# EAGLE design Project_Amp_RevA (EAGLE 7.5.0)
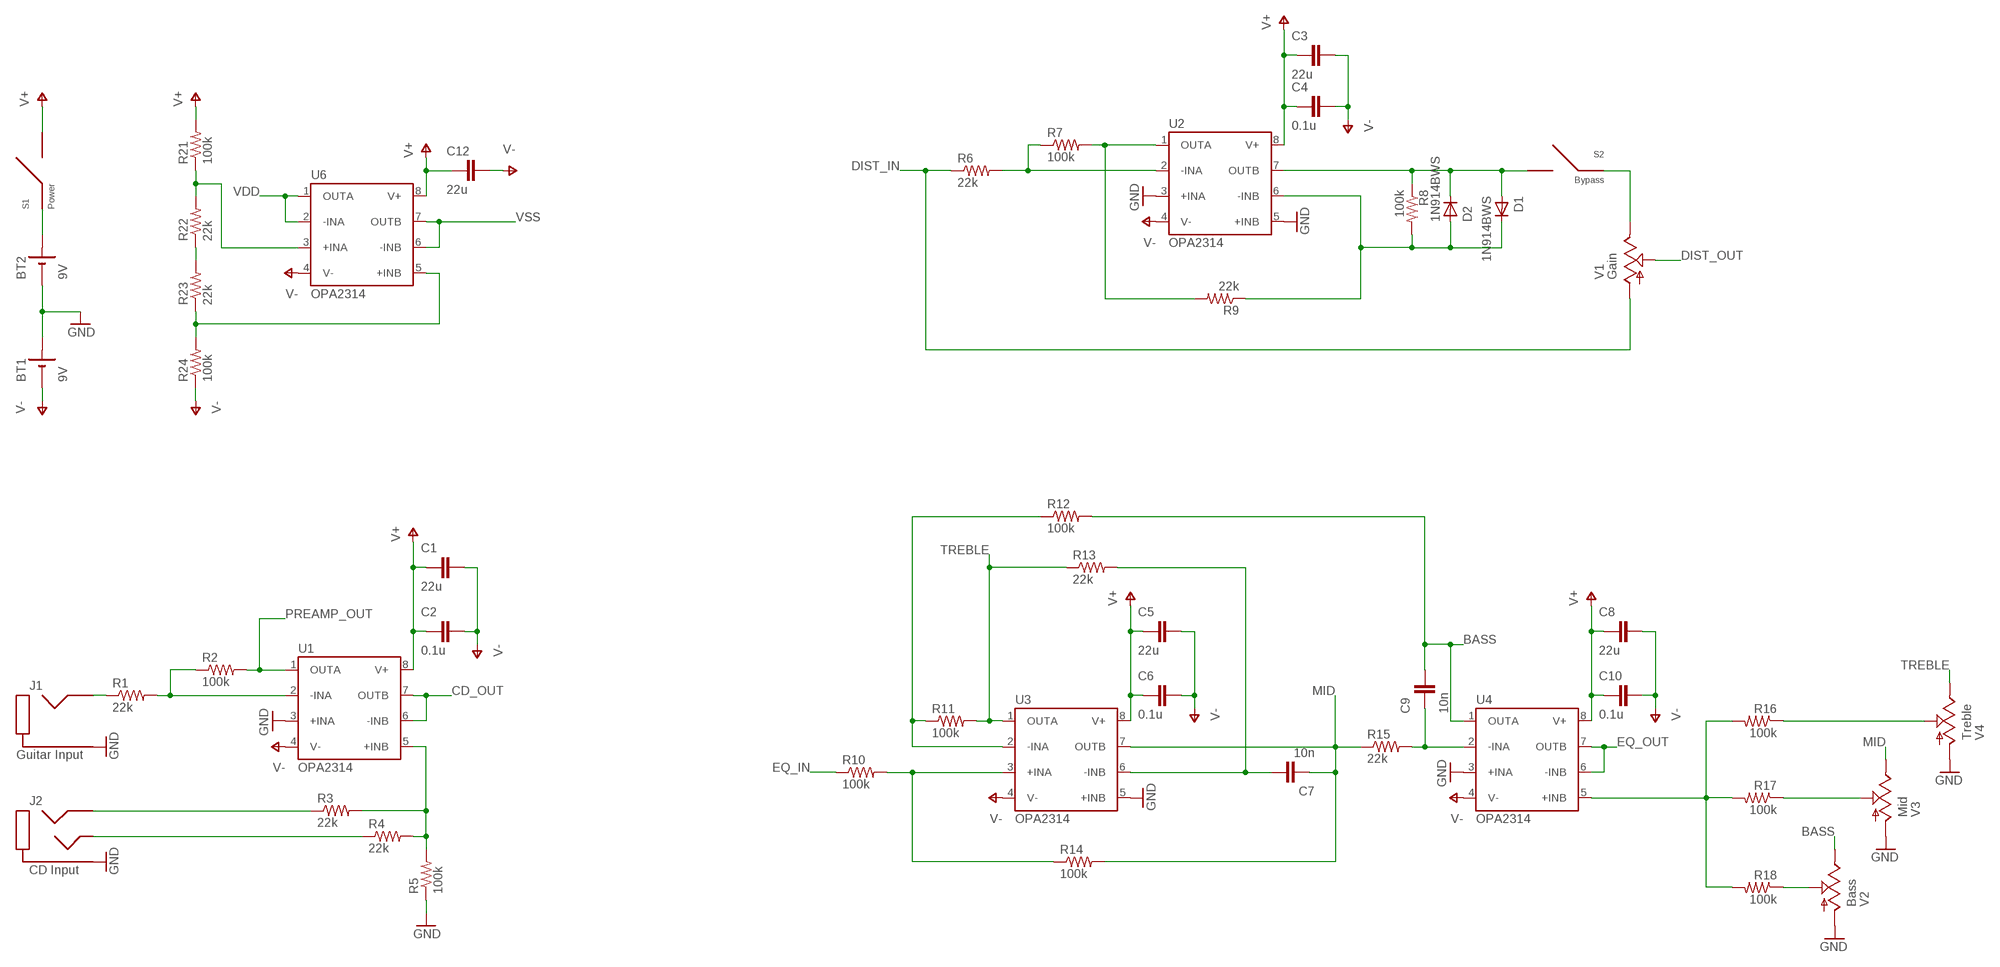
[diagram p0: schematic, sheet 1, part 1 of 2]
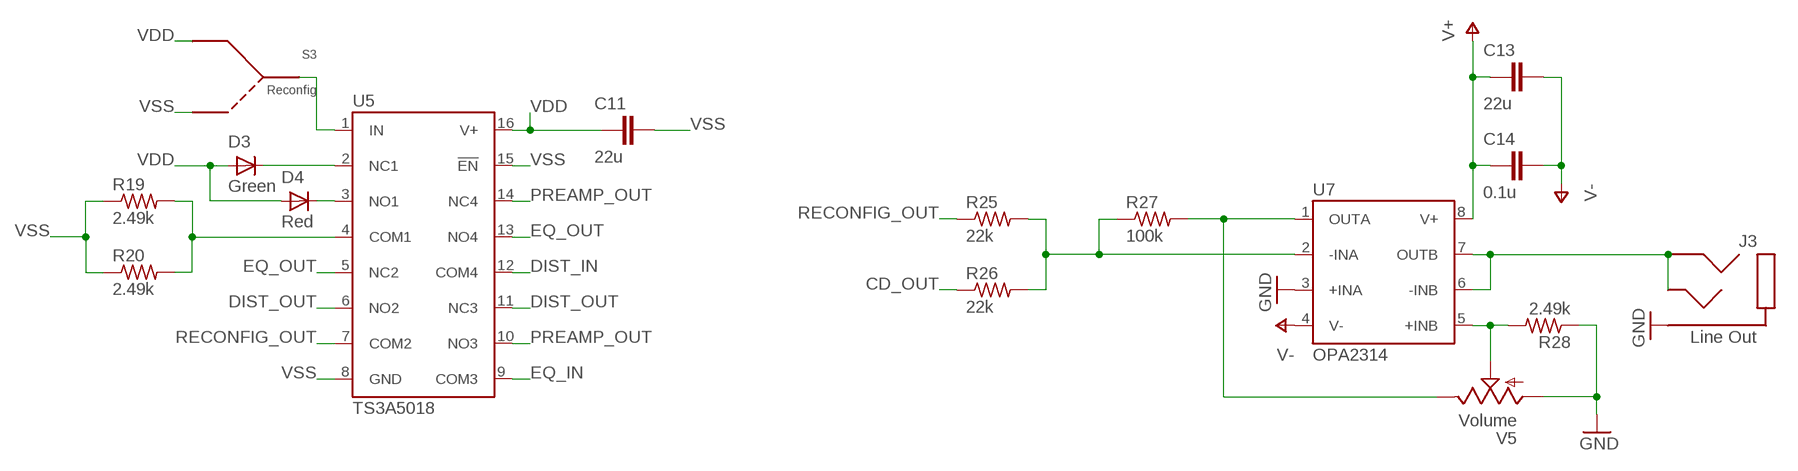
[diagram p1: schematic, sheet 1, part 2 of 2]

## Parts
BT1  9V  9V59X"  [9V59X]
BT2  9V  9V59X"  [9V59X]
C1  22u  C1206  [C1206]
C2  0.1u  C0402  [C0402]
C3  22u  C1206  [C1206]
C4  0.1u  C0402  [C0402]
C5  22u  C1206  [C1206]
C6  0.1u  C0402  [C0402]
C7  10n  CTHRU  [ECW-F6103HL]
C8  22u  C1206  [C1206]
C9  10n  CTHRU  [ECW-F6103HL]
C10  0.1u  C0402  [C0402]
C11  22u  C1206  [C1206]
C12  22u  C1206  [C1206]
C13  22u  C1206  [C1206]
C14  0.1u  C0402  [C0402]
D1  1N914BWS  DSOD-323F  [SOD-323F]
D2  1N914BWS  DSOD-323F  [SOD-323F]
D3  Green  D  [R0402]
D4  Red  D  [R0402]
J1  Guitar Input  RA49C12B  [RA49C12B]
J2  CD Input  SJ1-3513-SMT-TR  [SJ1-3513-SMT-TR]
J3  Line Out  SJ1-3513-SMT-TR  [SJ1-3513-SMT-TR]
R1  22k  R0402  [R0402]
R2  100k  R0402  [R0402]
R3  22k  R0402  [R0402]
R4  22k  R0402  [R0402]
R5  100k  R0402  [R0402]
R6  22k  R0402  [R0402]
R7  100k  R0402  [R0402]
R8  100k  R0402  [R0402]
R9  22k  R0402  [R0402]
R10  100k  R0402  [R0402]
R11  100k  R0402  [R0402]
R12  100k  R0402  [R0402]
R13  22k  R0402  [R0402]
R14  100k  R0402  [R0402]
R15  22k  R0402  [R0402]
R16  100k  R0402  [R0402]
R17  100k  R0402  [R0402]
R18  100k  R0402  [R0402]
R19  2.49k  R0402  [R0402]
R20  2.49k  R0402  [R0402]
R21  100k  R0402  [R0402]
R22  22k  R0402  [R0402]
R23  22k  R0402  [R0402]
R24  100k  R0402  [R0402]
R25  22k  R0402  [R0402]
R26  22k  R0402  [R0402]
R27  100k  R0402  [R0402]
R28  2.49k  R0402  [R0402]
S1  Power  TMS6T5B2M2RE  [TMS6T5B2M2RE]
S2  Bypass  TMS6T5B2M2RE  [TMS6T5B2M2RE]
S3  Reconfig  TMS1T5B2M2RE  [TMS1T5B2M2R]
U1  OPA2314  OPA2314SOIC  [8-SOIC]
U2  OPA2314  OPA2314SOIC  [8-SOIC]
U3  OPA2314  OPA2314SOIC  [8-SOIC]
U4  OPA2314  OPA2314SOIC  [8-SOIC]
U5  TS3A5018  TS3A501816-SOIC  [16-SOIC]
U6  OPA2314  OPA2314SOIC  [8-SOIC]
U7  OPA2314  OPA2314SOIC  [8-SOIC]
V1  Gain  POT  [P0915N-EC15BR10K]
V2  Bass  POT  [P0915N-EC15BR10K]
V3  Mid  POT  [P0915N-EC15BR10K]
V4  Treble  POT  [P0915N-EC15BR10K]
V5  Volume  POT  [P0915N-EC15BR10K]

## Nets
BASS: C9.1 R12.2 U4.1(OUTA) V2.3(E)
CD_OUT: R26.1 U1.6(-INB) U1.7(OUTB)
DIST_IN: R6.1 U5.12(COM4) V1.1(A)
DIST_OUT: U5.6(NO2) U5.11(NC3) V1.2(S)
EQ_IN: R10.1 U5.9(COM3)
EQ_OUT: U4.6(-INB) U4.7(OUTB) U5.5(NC2) U5.13(NO4)
GND: BT1.4(+) BT1.5(+) BT1.6(+) BT2.1(-) BT2.2(-) BT2.3(-) J1.S1(COM) J1.S2(COM) J2.1(COM) J3.1(COM) R5.1 R28.1 U1.3(+INA) U2.3(+INA) U2.5(+INB) U3.5(+INB) U4.3(+INA) U7.3(+INA) V2.1(A) V3.1(A) V4.1(A) V5.1(A)
LINE_OUT: J3.2(LEFT) J3.3(RIGHT) U7.6(-INB) U7.7(OUTB)
MID: C7.2 R14.2 R15.1 U3.7(OUTB) V3.3(E)
N$1: R21.1 R22.2 U6.3(+INA)
N$2: J1.T(SIG) R1.1
N$3: R1.2 R2.1 U1.2(-INA)
N$4: R3.2 R4.2 R5.2 U1.5(+INB)
N$5: R22.1 R23.2
N$6: J2.2(LEFT) R4.1
N$7: J2.3(RIGHT) R3.1
N$8: R23.1 R24.2 U6.5(+INB)
N$9: D3.2(C) U5.2(NC1)
N$10: R19.2 R20.2 U5.4(COM1)
N$11: D1.2(A) D2.1(C) R8.1 S2.1 U2.7(OUTB)
N$12: D1.1(C) D2.2(A) R8.2 R9.1 U2.6(-INB)
N$13: R7.2 R9.2 U2.1(OUTA)
N$14: R6.2 R7.1 U2.2(-INA)
N$15: S2.3 V1.3(E)
N$16: R16.2 R17.2 R18.2 U4.5(+INB)
N$17: R16.1 V4.2(S)
N$18: R17.1 V3.2(S)
N$19: R18.1 V2.2(S)
N$20: R10.2 R14.1 U3.3(+INA)
N$21: R11.1 R12.1 U3.2(-INA)
N$22: C7.1 R13.2 U3.6(-INB)
N$23: C9.2 R15.2 U4.2(-INA)
N$24: R27.2 U7.1(OUTA) V5.3(E)
N$25: R25.2 R26.2 R27.1 U7.2(-INA)
N$26: R28.2 U7.5(+INB) V5.2(S)
N$27: BT2.4(+) BT2.5(+) BT2.6(+) S1.3
N$28: S3.2(COM) U5.1(IN)
N$29: D4.2(C) U5.3(NO1)
PREAMP_OUT: R2.2 U1.1(OUTA) U5.10(NO3) U5.14(NC4)
RECONFIG_OUT: R25.1 U5.7(COM2)
TREBLE: R11.2 R13.1 U3.1(OUTA) V4.3(E)
V+: C1.2 C2.2 C3.2 C4.2 C5.2 C6.2 C8.2 C10.2 C12.2 C13.2 C14.2 R21.2 S1.1 U1.8(V+) U2.8(V+) U3.8(V+) U4.8(V+) U6.8(V+) U7.8(V+)
V-: BT1.1(-) BT1.2(-) BT1.3(-) C1.1 C2.1 C3.1 C4.1 C5.1 C6.1 C8.1 C10.1 C12.1 C13.1 C14.1 R24.1 U1.4(V-) U2.4(V-) U3.4(V-) U4.4(V-) U6.4(V-) U7.4(V-)
VDD: C11.2 D3.1(A) D4.1(A) S3.3(POS1) U5.16(V+) U6.1(OUTA) U6.2(-INA)
VSS: C11.1 R19.1 R20.1 S3.1(POS2) U5.8(GND) U5.15(!EN) U6.6(-INB) U6.7(OUTB)

## Library data of the parts
BT1 BT2 = amplifier:9V59X
C1-C14 = amplifier:C
D1-D4 = amplifier:D
J1 = amplifier:RA49C12B
J2 J3 = amplifier:SJ1-3513-SMT-TR
R1-R28 = amplifier:R
S1 S2 = amplifier:TMS6T5B2M2RE
S3 = amplifier:TMS1T5B2M2RE
U1-U4 U6 U7 = amplifier:OPA2314
U5 = amplifier:TS3A5018
V1-V5 = amplifier:POT

## Net classes
0 default: width 0.025 mm

## Board
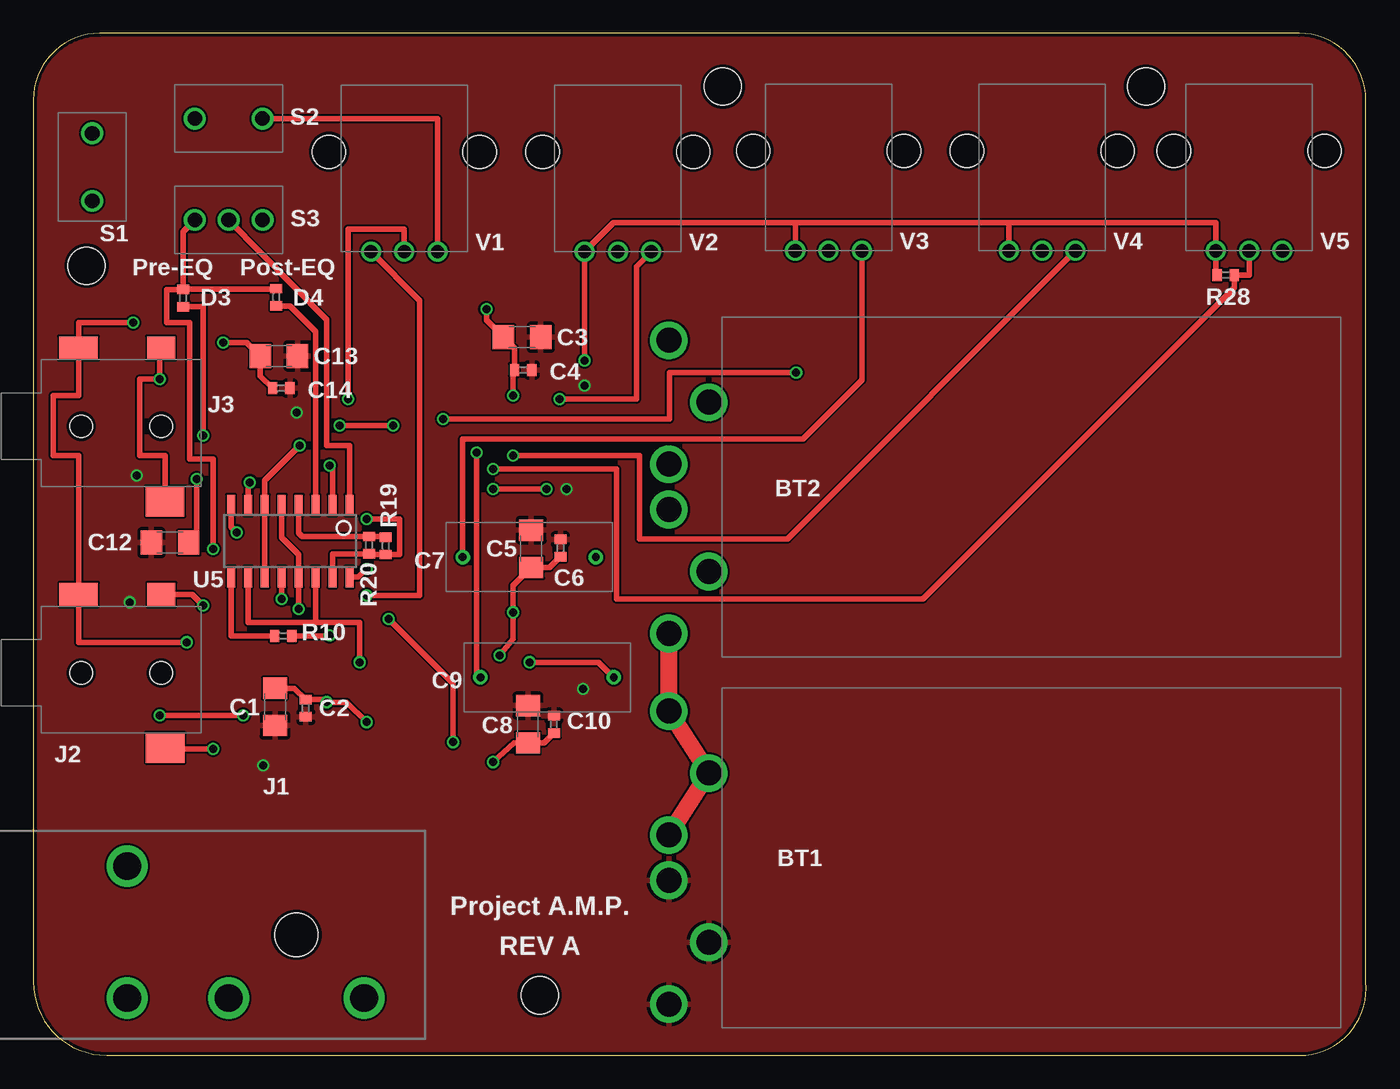
[diagram p2: board, top side]
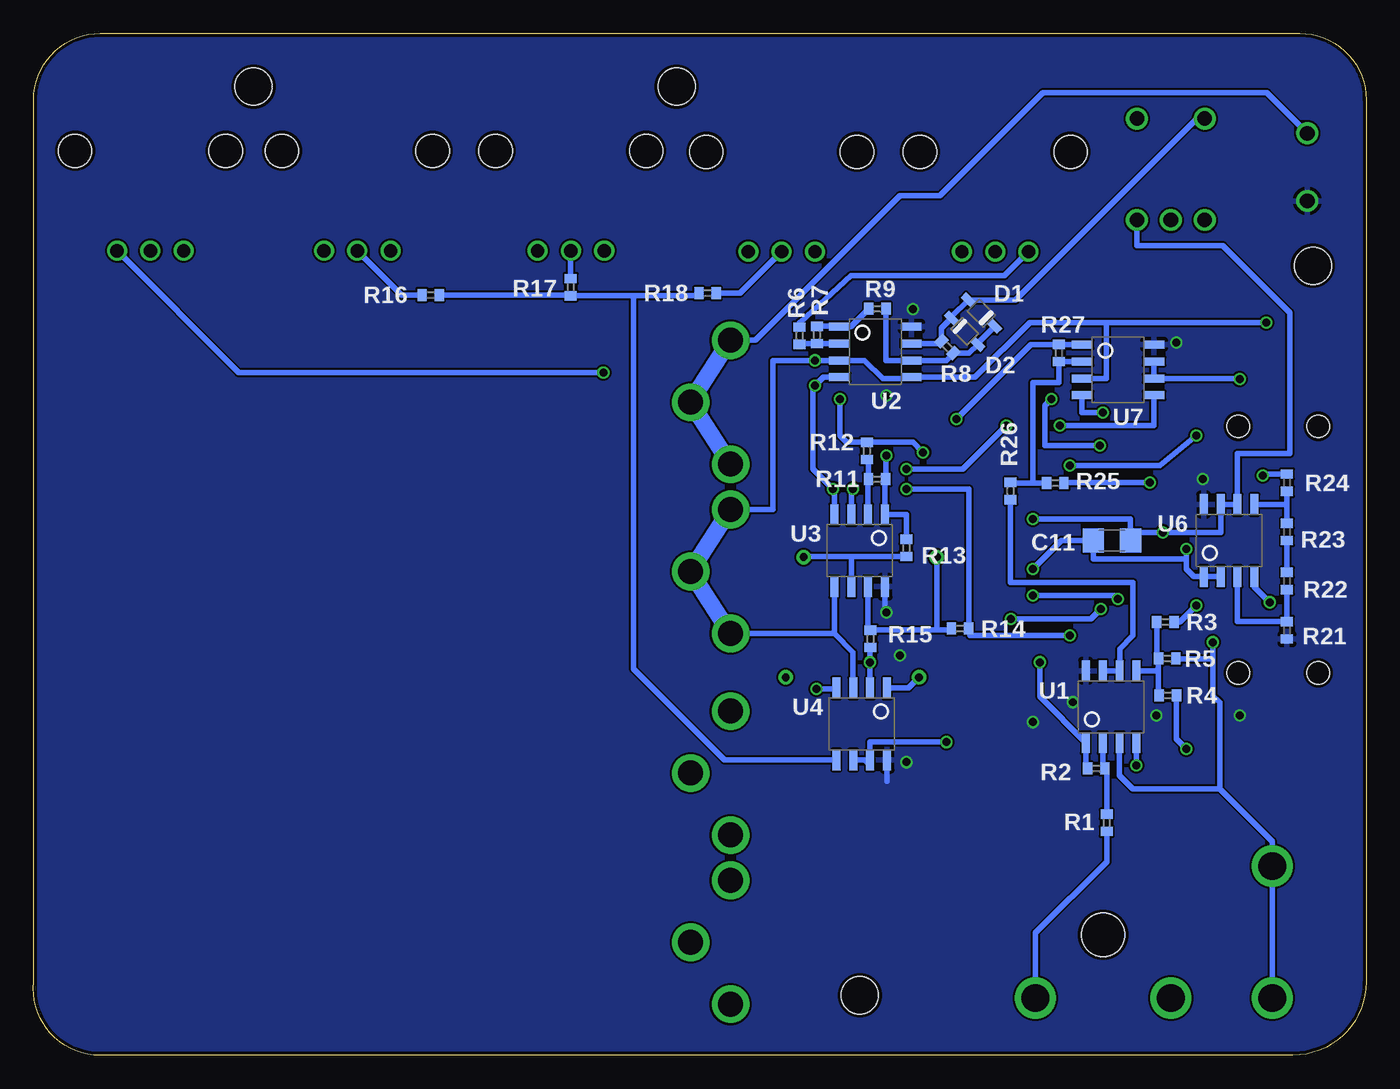
[diagram p3: board, bottom side, seen from below]

Size 100.02 x 76.7 mm. Coordinates in mm from the lower left corner, seen from the top.
Outline: 0,71.7 0,5.5 arc90 5.5,0 95.5,0 arc90 100,5.5 100,71.7 arc90 95,76.7 5,76.7 arc90 0,71.7
Copper layers (1*16): Top 0.035mm / dielectric 1.5mm / Bottom 0.035mm
Design rules "SeeedStudio_2layer_DRU_no_angle_20140221 *": minimum track width 6mil, minimum drill 12mil, track to track 6mil, track to pad 6mil, pad to pad 6mil, via to via 6mil, smd to smd 0mil, copper to edge 10mil, drill to drill 10mil, minimum pad ring 10mil, minimum via ring 6mil, stop-mask expansion 2mil, vias tented up to drill 24mil, thermal gap 10mil
Holes 2.8 mm at 4,59.25 83.5,72.7 38,4.5 51.75,72.7

### Footprints (pad centres in the part's own frame; a part is rotated, then mirrored left to right if it is on the bottom)
9V59X = drill 1.88: 1 -11,0; 2 -6.35,-3; 3 -1.7,0; 4 1.7,0; 5 6.35,-3; 6 11,0
C1206 = smd 1.6 x 1.8: 1 -1.4,0; 2 1.4,0
C0402 = smd 0.7 x 0.9: 1 -0.65,0; 2 0.65,0
ECW-F6103HL = drill 0.58: 1 -5,0; 2 5,0
SOD-323F = smd 0.55 x 1.05: 1 0,1.4; 2 0,-1.4
R0402 = smd 0.7 x 0.9: 1 -0.65,0; 2 0.65,0
RA49C12B = drill 2.08: R 5.08,4.75; S1 12.7,4.75; S2 12.7,-5.16; T -5.08,4.75 | hole 3.25: 0,0
SJ1-3513-SMT-TR = smd 2.9 x 1.75: 1 2.8,5.875 | smd 2.9 x 2.25: 2 9.3,-5.625 | smd 2.1 x 1.75: 3 9,5.875 | hole 1.68: 3,0; 9,0
TMS6T5B2M2RE = drill 1.09: 1 0,-2.54; 3 0,2.54
TMS1T5B2M2R = drill 1.09: 1 0,-2.54; 2 0,0; 3 0,2.54
8-SOIC = smd 0.6 x 1.55: 1 -1.905,-2.7; 2 -0.635,-2.7; 3 0.635,-2.7; 4 1.905,-2.7; 5 1.905,2.7; 6 0.635,2.7; 7 -0.635,2.7; 8 -1.905,2.7
16-SOIC = smd 0.6 x 1.55: 1 -4.445,-2.7; 2 -3.175,-2.7; 3 -1.905,-2.7; 4 -0.635,-2.7; 5 0.635,-2.7; 6 1.905,-2.7; 7 3.175,-2.7; 8 4.445,-2.7; 9 4.445,2.7; 10 3.175,2.7; 11 1.905,2.7; 12 0.635,2.7; 13 -0.635,2.7; 14 -1.905,2.7; 15 -3.175,2.7; 16 -4.445,2.7
P0915N-EC15BR10K = drill 1: 1 -2.5,0; 2 0,0; 3 2.5,0 | hole 2.5: -5.65,7.5; 5.65,7.5

### Placement (x,y rotation side)
BT1  47.7,14.83 90 top
BT2  47.7,42.66 90 top
C1  18.14,26.15 90 top
C2  20.44,26.05 90 top
C3  36.68,53.89 180 top
C4  36.76,51.44 180 top
C5  37.36,38.01 270 top
C6  39.56,38.07 270 top
C7  37.22,37.39 180 top
C8  37.11,24.84 270 top
C9  38.56,28.36 0 top
C10  39.06,24.83 270 top
C11  19.08,38.64 180 bottom
C12  10.26,38.48 0 top
C13  18.43,52.48 180 top
C14  18.61,50.06 180 top
D1  28.87,55.7 225 bottom
D2  30.13,54.34 45 bottom
D3  11.23,56.83 270 top
D4  18.23,56.89 270 top
J1  19.74,9.04 180 top
J2  0.6,28.7 0 top
J3  0.59,47.2 0 top
R1  19.48,17.45 90 bottom
R2  20.26,21.52 180 bottom
R3  15.07,32.52 180 bottom
R4  14.88,27.02 180 bottom
R5  14.94,29.77 180 bottom
R6  42.52,54 270 bottom
R7  41.23,54.06 90 bottom
R8  31.43,53.15 315 bottom
R9  36.68,56.02 180 bottom
R10  18.76,31.48 0 top
R11  36.7,43.23 0 bottom
R12  37.48,45.36 90 bottom
R13  34.52,38.08 270 bottom
R14  30.48,32.02 180 bottom
R15  37.19,31.26 270 bottom
R16  70.2,57.06 0 bottom
R17  59.69,57.64 270 bottom
R18  49.42,57.19 180 bottom
R19  26.44,38.23 90 top
R20  25.19,38.29 90 top
R21  5.94,31.9 270 bottom
R22  5.94,35.59 270 bottom
R23  5.94,39.28 270 bottom
R24  5.94,42.97 270 bottom
R25  23.34,42.94 180 bottom
R26  26.69,42.35 90 bottom
R27  23.06,52.71 90 bottom
R28  89.48,58.56 0 top
S1  4.42,66.66 0 top
S2  14.66,70.3 270 top
S3  14.66,62.69 90 top
U1  19.14,26.16 0 bottom
U2  36.84,52.79 270 bottom
U3  38.01,37.87 180 bottom
U4  37.86,24.87 180 bottom
U5  19.28,38.59 180 top
U6  10.29,38.63 0 bottom
U7  18.62,51.44 270 bottom
V1  27.84,60.31 0 top
V2  43.87,60.31 0 top
V3  59.68,60.38 0 top
V4  75.71,60.38 0 top
V5  91.24,60.38 0 top

### Tracks (layer width: path | path; a pad name or v marks a point on that pad's centre or on a via)
BASS  (via drill 0.6)
  Top 0.406: v39.5,49.25 45.25,49.25 45.25,59.19 V2.3 | v33.25,45.25 33.25,28.67 C9.1
  Bottom 0.406: v39.5,49.25 39.5,46.5 39.01,46.01 R12.2 34.01,46.01 v33.25,45.25 | U4.1 34.35,27.57 C9.1
CD_OUT
  Bottom 0.406: U1.7 U1.6 18.5,30.5 17.5,31.5 17.5,35.5 26.69,35.5 R26.1
DIST_IN  (via drill 0.6)
  Top 0.406: v25,34.5 29,34.5 29,56.65 V1.1 | U5.12 v18.64,34.25
  Bottom 0.406: V1.1 27.15,58.5 38.67,58.5 42.5,55 42.52,54.98 R6.1 | v18.64,34.25 18.89,34.5 v25,34.5
DIST_OUT  (via drill 0.6)
  Top 0.406: U5.11 U5.6 17.38,43.12 v20,45.75 | v23.62,49.25 23.62,62 27.84,62 V1.2
  Bottom 0.406: v20,45.75 24.12,45.75 24.12,48.75 v23.62,49.25
EQ_IN
  Top 0.406: U5.9 14.84,31.48 R10.1
EQ_OUT  (via drill 0.6)
  Top 0.406: U5.5 18.64,38.85 19.91,37.59 U5.13 v19.91,33.5 | v31.5,23.5 31.5,27.91 v26.66,32.75
  Bottom 0.406: U4.7 U4.6 | U4.7 37.33,22.17 37.5,22 | U4.7 37.23,23.5 v31.5,23.5 | v19.91,33.5 20.66,32.75 v26.66,32.75
GND  (via drill 0.6)
  Top 0.406: v11.5,31 3.4,31 J2.1 3.4,45 1.5,45 1.5,49.5 3.39,49.5 J3.1 3.39,55 v7.5,55 | 57.18,62.5 43.56,62.5 V2.1 v41.37,52.16 | 73.21,62.5 88.74,62.5 V5.1 88.74,58.65 R28.1 | 57.18,62.5 73.21,62.5 | 73.21,62.5 V4.1 | 57.18,62.5 V3.1
  Top 1.27: BT1.4 BT1.5 BT1.6 BT2.1
  Bottom 0.406: U1.3 | 18.5,23.25 U1.3 | U4.3 38.5,30.24 39.92,31.66 | U1.3 18.5,21 17.5,20 11,20 | 11,20 11,26.48 11.5,26.98 11.5,29.75 | BT2.1 39.92,31.66 | 11,20 7.04,16.04 J1.S2 J1.S1 | 39.92,31.66 U3.5 | BT2.3 44.5,40.96 44.5,52.16 v41.37,52.16 U2.3 37.66,52.16 36.27,50.77 34.25,50.77 U2.5 29.36,50.88 25.25,55 19.5,55 | 11.5,29.75 v11.5,31 | R5.1 14.27,29.75 11.5,29.75 | v7.5,55 19.5,55 | 19.5,55 19.5,50.8 U7.3
  Bottom 1.27: BT2.1 BT2.2 BT2.3
LINE_OUT  (via drill 0.6)
  Top 0.406: J3.2 9.89,45 8,45 8,50.75 v9.5,50.75 9.5,52.98 J3.3
  Bottom 0.406: 15.87,50.75 U7.6 | U7.7 U7.6 | U7.6 9.55,50.8 v9.5,50.75
MID
  Top 0.406: C7.2 32.22,46.25 57.75,46.25 62.18,50.68 V3.3
  Bottom 0.406: U3.7 37.38,32.09 R15.1 32.5,31.91 32.22,31.91 | 32.22,31.91 31.24,31.91 R14.2 | C7.2 32.22,31.91
N$1
  Bottom 0.406: U6.3 9.65,32.55 R21.1 R22.2
N$2
  Bottom 0.406: J1.T 24.82,9.18 19.48,14.52 R1.1
N$3
  Bottom 0.406: R1.2 19.48,21.39 R2.1 19.77,21.68 U1.2
N$4
  Bottom 0.406: R4.2 15.59,27.64 15.59,29 | 15.59,29 R5.2 15.72,29.9 R3.2 | U1.5 15.73,28.86 15.59,29
N$5
  Bottom 0.406: R22.1 R23.2
N$6  (via drill 0.6)
  Top 0.406: J2.2 9.97,23 v13.5,23
  Bottom 0.406: v13.5,23 14.23,23.73 R4.1
N$7  (via drill 0.6)
  Top 0.406: 9.68,34.5 J2.3 11.93,34.58 v12.75,33.75
  Bottom 0.406: v12.75,33.75 13.98,32.52 R3.1
N$8
  Bottom 0.406: R24.2 5.94,41.33 | 5.94,41.33 R23.1 | U6.5 5.94,41.33
N$9  (via drill 0.6)
  Top 0.406: v12.75,46.5 12.75,56.18 D3.2 | U5.2 22.45,44.05 v22.25,44.25
  Bottom 0.406: v22.25,44.25 15.5,44.25 v12.75,46.5
N$10
  Top 0.406: U5.4 19.91,39.19 20.16,38.94 R20.2 26.44,38.94 R19.2
N$11
  Bottom 0.406: U2.7 32.08,53.42 R8.1 31.89,54.56 D2.1 31.12,55.43 D1.2 26.31,56.69 12.7,70.3 S2.1
N$12
  Bottom 0.406: R9.1 36.03,52.16 U2.6 31.51,52.16 R8.2 29.8,52.69 D2.2 29.14,53.45 D1.1
N$13
  Bottom 0.406: R7.2 U2.1 38.66,54.7 R9.2
N$14
  Bottom 0.406: U2.2 39.54,53.5 39.5,53.5 39.5,53.41 R7.1 42.46,53.41 R6.2
N$15
  Top 0.406: S2.3 30.34,70.3 V1.3
N$16
  Bottom 0.406: U4.5 48.17,22.17 55,29 55,57.01 | 55,57.01 59.67,57.01 R17.2 59.75,57.05 R16.2 | 55,57.01 50.25,57.01 R18.2
N$17
  Bottom 0.406: R16.1 72.39,57.06 V4.2
N$18
  Bottom 0.406: V3.2 R17.1
N$19
  Bottom 0.406: R18.1 46.99,57.19 V2.2
N$20  (via drill 0.6)
  Top 0.406: v34.5,42.5 v38.5,42.5 | R10.2 22.23,31.48 v22.25,31.5
  Bottom 0.406: U3.3 38.65,42.35 v38.5,42.5 | v22.25,31.5 29.75,31.5 29.75,31.94 R14.1 29.83,42.5 v34.5,42.5
N$21
  Bottom 0.406: U3.2 37.38,43.2 R11.1 37.35,44.58 R12.1
N$22
  Bottom 0.406: R13.2 38.65,37.43 | 38.65,37.43 U3.6 | 38.65,37.43 42.18,37.43 C7.1
N$23  (via drill 0.6)
  Top 0.406: C9.2 42.42,29.5 v37.25,29.5
  Bottom 0.406: 37.25,30.55 arc90 37.23,30.57 R15.2 37.25,30.61 v37.25,29.5 37.25,27.59 U4.2
N$24  (via drill 0.6)
  Top 0.406: v30.75,47.75 47.75,47.75 47.75,51.25 v57.25,51.25
  Bottom 0.406: U7.1 23.05,53.34 R27.2 23.3,53.34 25.16,53.34 v30.75,47.75 | V5.3 84.61,51.25 v57.25,51.25
N$25
  Bottom 0.406: U7.2 23.05,52.08 R27.1 23.06,50.5 25,50.5 25,42.94 | R25.2 25,42.94 | 25,42.94 26.69,42.94 R26.2
N$26  (via drill 0.6)
  Top 0.406: v34.5,44 43.75,44 43.75,34.25 66.75,34.25 90.13,57.63 R28.2 91.24,58.56 V5.2 | v23,47.25 v27,47.25
  Bottom 0.406: 15.96,49.53 U7.5 15.92,47.25 v23,47.25 | v34.5,44 30.25,44 v27,47.25
N$27
  Bottom 0.406: S1.3 7.47,72.25 24.25,72.25 31.75,64.75 32,64.5 35,64.5 45.84,53.66 BT2.6
  Bottom 1.27: BT2.4 BT2.5 BT2.6
N$28
  Top 0.406: S3.2 22,55.23 22,45.75 23.73,45.75 U5.1
N$29
  Top 0.406: U5.3 21.18,54.31 19.26,56.24 D4.2
PREAMP_OUT  (via drill 0.6)
  Top 0.406: 21.18,32.5 U5.14 | U5.10 16.11,32.5 21.18,32.5 | 21.18,32.5 24.5,32.5 v24.5,29.5
  Bottom 0.406: v24.5,29.5 24.5,26.91 U1.1 21.05,21.66 R2.2
RECONFIG_OUT  (via drill 0.6)
  Top 0.406: U5.7 16.11,42.85 v16.25,43
  Bottom 0.406: v16.25,43 22.69,43 R25.1
TREBLE  (via drill 0.6)
  Top 0.406: v36,45 45.5,45 45.5,38.75 56.58,38.75 V4.3
  Bottom 0.406: R13.1 34.52,40.57 U3.1 36.1,43.17 R11.2 36.05,45 v36,45
V+  (via drill 0.6)
  Top 0.406: C6.2 38.75,36.61 C5.2 36,35.25 v36,33.25 36,31.25 v35,30 | C10.2 38.32,23.44 C8.2 36.06,23.44 v34.5,22 | v14.25,53.5 16.01,53.5 C13.2 17.03,50.99 C14.2 | C1.2 19.59,27.55 C2.2 21.8,26.7 v22,26.5 23.5,26.5 v25,25 | v12.25,43.25 12.25,39.07 C12.2 | v9.5,25.5 v15.75,25.5 | v34,56 34,55.17 C3.2 36.11,53.06 C4.2 36,51.33 v36,49.5
  Bottom 0.406: U3.8 36.1,33.35 v36,33.25 | 35.95,20.55 U4.8
  pour Bottom: -5.5,78 -5.5,-2 104.5,-2 104.5,78
V-  (via drill 0.6)
  Bottom 0.406: U1.4 17.23,21.75 v17.25,21.75 | U3.4 39.91,42.41 v40,42.5 41.5,44 41.5,50 | U7.4 21.32,48.25 v19.75,48.25 | R24.1 7.63,43.62 v7.75,43.5 | 39.77,28.02 U4.4 39.84,27.5 v41.25,27.5 | U6.4 8.38,35.13 v7.25,34 | U2.4 40.73,50.88 v41.37,50.25
  pour Top: -5,78.5 -5,-2 103,-2 103,78.5
VDD  (via drill 0.6)
  Top 0.406: 10.98,57.48 D3.1 | D3.1 11.25,57.5 18.19,57.5 D4.1 | D3.1 10,57.48 10,55 11.75,55 11.75,44.75 13.5,44.75 v13.5,38 | S3.3 11.23,61.8 D3.1 | U5.16 24.39,35.89 v25,36.5
  Bottom 0.406: U6.2 U6.1 12.93,35.93 13.5,36.5 13.5,37.25 | v13.5,38 13.5,37.25 | 13.5,37.25 20.48,37.25 C11.2 22.86,38.64 v25,36.5
VSS  (via drill 0.6)
  Top 0.406: v15.25,39.25 14.84,39.66 U5.8 | U5.15 22.45,37.64 R20.1 25.19,37.58 R19.1 27.5,37.58 27.5,40.25 v25,40.25
  Bottom 0.406: v25,40.25 17.68,40.25 C11.1 17.07,39.25 v15.25,39.25 10.93,39.25 U6.7 U6.6 9.65,45.16 5.75,45.16 5.75,55.75 10.75,60.75 17.2,60.75 S3.1

### Text on the board
tPlace: Pre-EQ | Post-EQ | Project A.M.P. | REV A